# Altium schematic sheet NEB_PSU_CYCLONE.SCHDOC: Cyclone Power Supply
size A4; Organization: Altium Limited; Address1: L3, 12a Rodborough Rd; Address2: Frenchs Forest; Address3: NSW; Address4: Australia 2086; DocumentNumber: 7; SheetNumber: 7; SheetTotal: 10
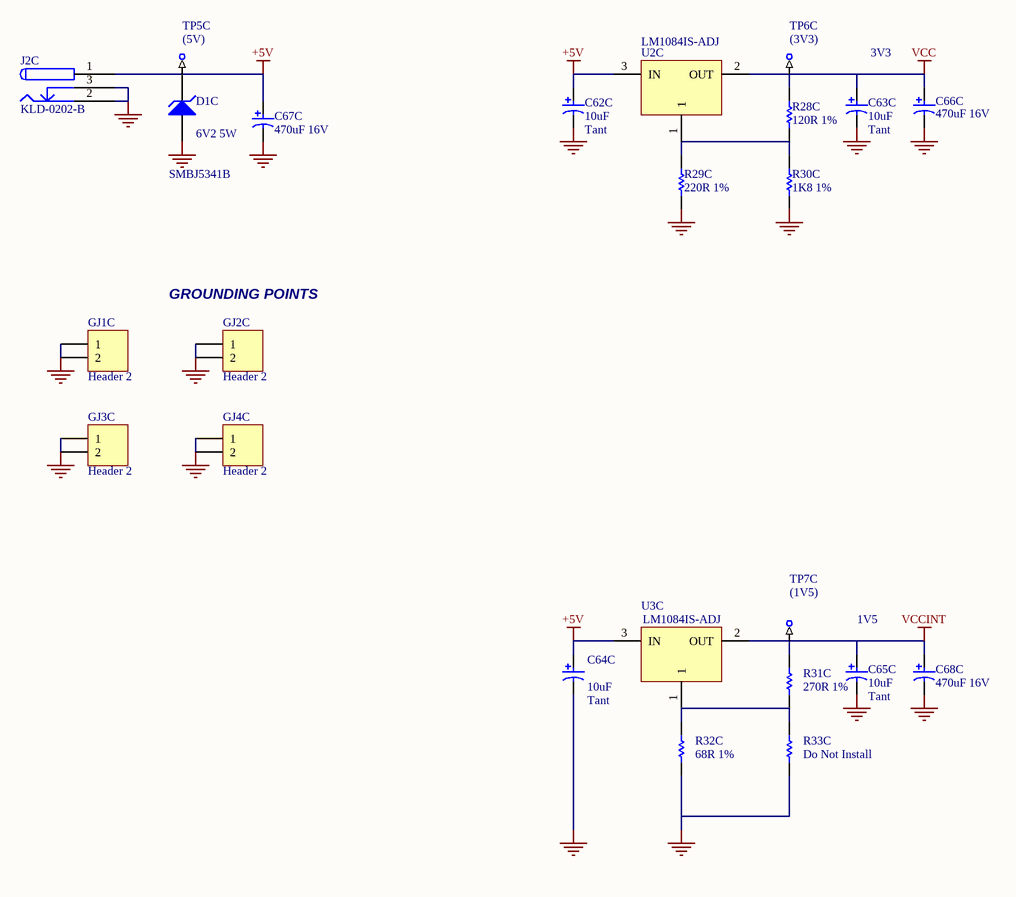
[diagram p0: NEB_PSU_CYCLONE.SCHDOC]

## Parts
C62C  10uF  Capacitor Type: Tant  [MCCT-B]
C63C  10uF  Capacitor Type: Tant  [MCCT-B]
C64C  10uF  Capacitor Type: Tant  [MCCT-B]
C65C  10uF  Capacitor Type: Tant  [MCCT-B]
C66C  470uF 16V  [RB8/3.5]
C67C  470uF 16V  [RB8/3.5]
C68C  470uF 16V  [RB8/3.5]
D1C  SMBJ5341B  Part Description: 6V2 5W  [DO214]
GJ1C  Header 2  [HDR1X2]
GJ2C  Header 2  [HDR1X2]
GJ3C  Header 2  [HDR1X2]
GJ4C  Header 2  [HDR1X2]
J2C  KLD-0202-B  [KLD-0202]
R28C  120R 1%  [CR2012-0805]
R29C  220R 1%  [CR2012-0805]
R30C  1K8 1%  [CR2012-0805]
R31C  270R 1%  [CR2012-0805]
R32C  68R 1%  [CR2012-0805]
R33C  Do Not Install  [CC2012-0805]
TP5C  (5V)  [TestPin]  (no BOM)
TP6C  (3V3)  [TestPin]  (no BOM)
TP7C  (1V5)  [TestPin]  (no BOM)
U2C  LM1084IS-ADJ  [TO-263]
U3C  LM1084IS-ADJ  [TO-263]

## Nets
+5V: C62C.1 C64C.1 C67C.1 D1C.2(K) J2C.1 J2C.1A J2C.1B TP5C.1 U2C.3(IN) U3C.3(IN)
GND: C62C.2 C63C.2 C64C.2 C65C.2 C66C.2 C67C.2 C68C.2 D1C.1(A) GJ1C.1 GJ1C.2 GJ2C.1 GJ2C.2 GJ3C.1 GJ3C.2 GJ4C.1 GJ4C.2 J2C.2 J2C.2A J2C.2B J2C.3 J2C.3A J2C.3B R29C.1 R30C.1 R32C.1 R33C.2
VCC: C63C.1 C66C.1 R28C.2 TP6C.1 U2C.2(OUT) U2C.4(HeatSink)
VCCINT: C65C.1 C68C.1 R31C.2 TP7C.1 U3C.2(OUT) U3C.4(HeatSink)
NetR28C_1: R28C.1 R29C.2 R30C.2 U2C.1
NetR31C_1: R31C.1 R32C.2 R33C.1 U3C.1

## Notes on the sheet
- 3V3
- (near GJ2C) GROUNDING POINTS
- 1V5
- Title
- Size:
- Date:
- A4
- Number:
- Time:
- Revision:
- Sheet
- of
- File:

## Library data of the parts
C62C C63C C64C C65C C66C C67C C68C = CAP_POLAR: Polar Capacitor; Fitted: True
D1C = BZG03C13: Zener Diode, 6.2V, 5W; Manufacturer: Microsemi; Fitted: True; Revision: 31-Oct-2003
GJ1C GJ2C GJ3C GJ4C = Header 2: Header, 2-Pin; Manufacturer: Generic Components; Class I: Connector; Fitted: True; Revision: July-2002: Re-released for DXP Platform.; Publisher: Altium Limited
J2C = KLD-0202-B: Low Voltage Power Supply Connector; Manufacturer: Kycon; Fitted: True
R28C R29C R30C R31C R32C = RES: Resistor; Fitted: True
R33C = RES: Resistor
TP5C TP6C TP7C = TestPin
U2C U3C = LM1084IS-ADJ: 5A Low Dropout Positive Regulators; Manufacturer: National Semi; Published: 5-Jan-2004; Datasheet: Latest Revision: Aug-2002; Publisher: Altium Limited